# Altium schematic sheet 101_GridPos1.SchDoc: Grid Position 1 / USB 0
size A2; Organization: Greenfield Tech Solutions; Address1: Molendreef 33; Address2: Ossendrecht; Address3: 4641CS; Address4: The Netherlands; SheetNumber: 2; SheetTotal: 9
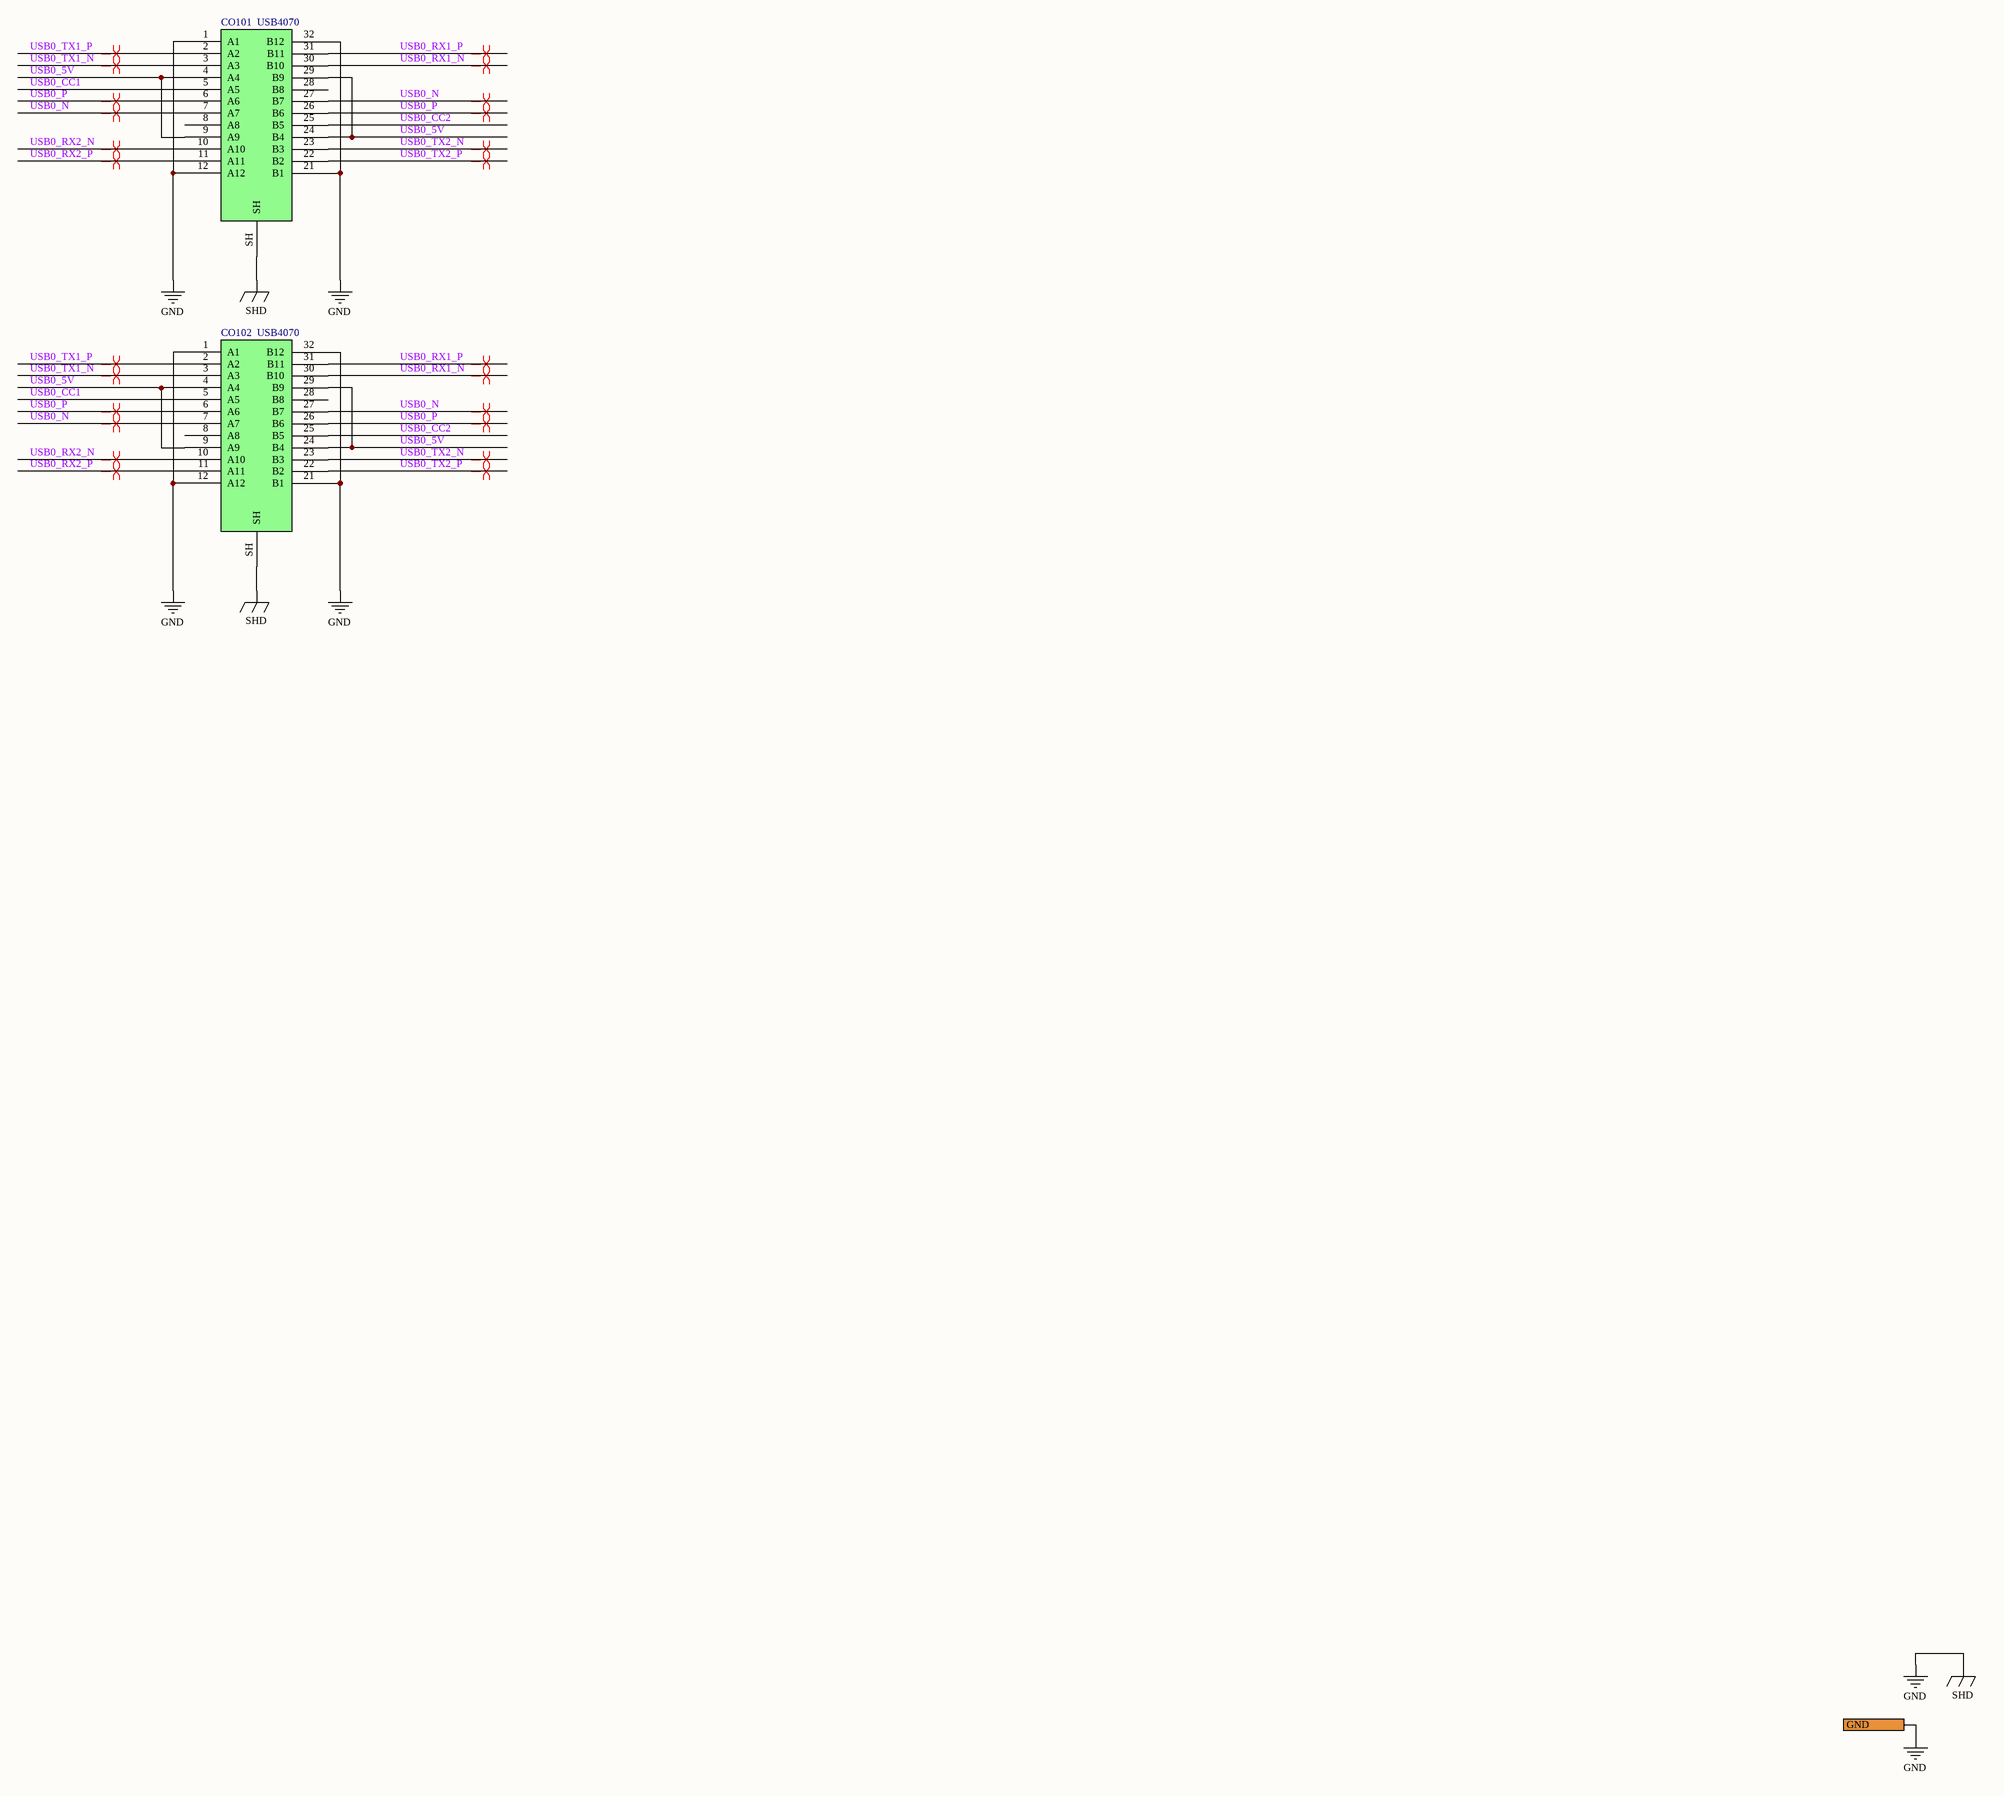
[diagram p0: 101_GridPos1.SchDoc]

## Parts
CO101  USB4070  [USB4070-30-C]
CO102  USB4070  [USB4070-30-C]

## Ports
GND

## Nets
GND: CO101.1(A1) CO101.12(A12) CO101.21(B1) CO101.32(B12) CO101.SH CO102.1(A1) CO102.12(A12) CO102.21(B1) CO102.32(B12) CO102.SH ; port GND  [also labelled SHD]
USB0_5V: CO101.4(A4) CO101.9(A9) CO101.24(B4) CO101.29(B9) CO102.4(A4) CO102.9(A9) CO102.24(B4) CO102.29(B9)
USB0_CC1: CO101.5(A5) CO102.5(A5)
USB0_CC2: CO101.25(B5) CO102.25(B5)
USB0_N: CO101.7(A7) CO101.27(B7) CO102.7(A7) CO102.27(B7)
USB0_P: CO101.6(A6) CO101.26(B6) CO102.6(A6) CO102.26(B6)
USB0_RX1_N: CO101.30(B10) CO102.30(B10)
USB0_RX1_P: CO101.31(B11) CO102.31(B11)
USB0_RX2_N: CO101.10(A10) CO102.10(A10)
USB0_RX2_P: CO101.11(A11) CO102.11(A11)
USB0_TX1_N: CO101.3(A3) CO102.3(A3)
USB0_TX1_P: CO101.2(A2) CO102.2(A2)
USB0_TX2_N: CO101.23(B3) CO102.23(B3)
USB0_TX2_P: CO101.22(B2) CO102.22(B2)

Not connected (* = marked no-connect by the designer): CO101 8(A8) 28(B8); CO102 8(A8) 28(B8)

## Layout directives
differential pair; differential pair class USB3: USB0_N, USB0_P, USB0_RX1_N, USB0_RX1_P, USB0_RX2_N, USB0_RX2_P, USB0_TX1_N, USB0_TX1_P, USB0_TX2_N, USB0_TX2_P

## Notes on the sheet
- Title
- Size:
- Date:
- File:
- A2
- Number:
- Time:
- Revision:
- Sheet
- of

## Library data of the parts
CO101 CO102 = CO0021: USB4070-30-C; Part Number: CO0021; ID: 16; RefVal: USB4070; ManfactPart: USB4070-30-C